# Altium schematic sheet DIGITAL-OUTPUT.SchDoc
size A
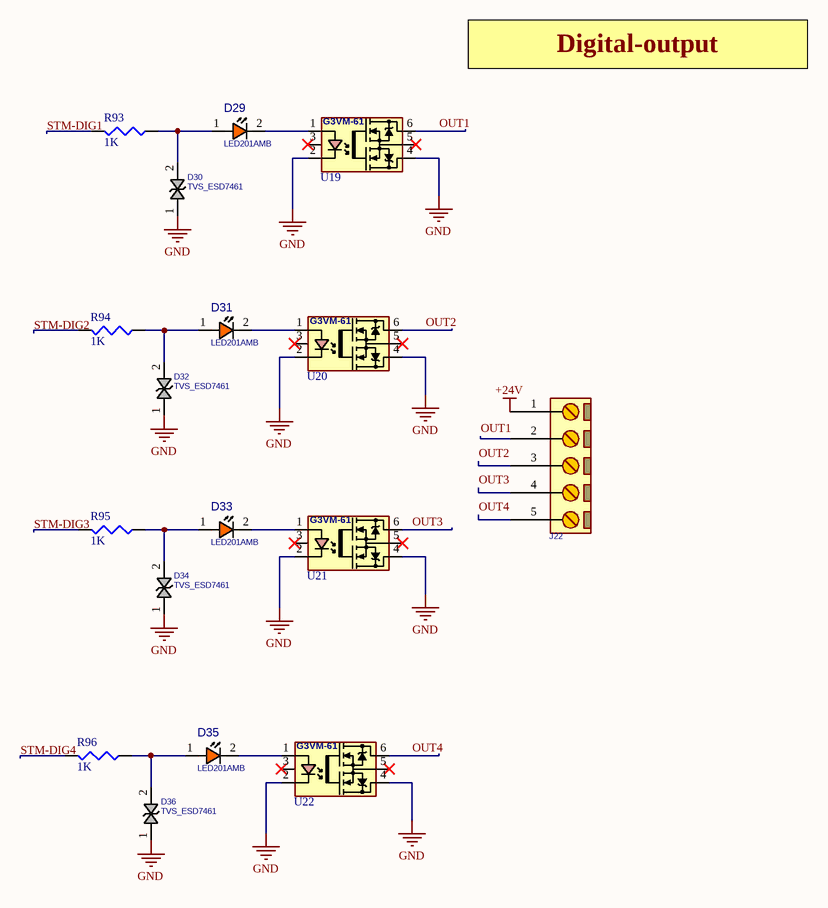
[diagram p0: DIGITAL-OUTPUT.SchDoc]

## Parts
D29  LED201AMB  [LED0201AMB]
D30  TVS_ESD7461  [ESD_XDFN2]
D31  LED201AMB  [LED0201AMB]
D32  TVS_ESD7461  [ESD_XDFN2]
D33  LED201AMB  [LED0201AMB]
D34  TVS_ESD7461  [ESD_XDFN2]
D35  LED201AMB  [LED0201AMB]
D36  TVS_ESD7461  [ESD_XDFN2]
J22  CONN_TB5  [MSTB_5]  (value not drawn)
R93  1K  [0603L]
R94  1K  [0603L]
R95  1K  [0603L]
R96  1K  [0603L]
U19  G3VM-61  [DIP_6SMD]  (value not drawn)
U20  G3VM-61  [DIP_6SMD]  (value not drawn)
U21  G3VM-61  [DIP_6SMD]  (value not drawn)
U22  G3VM-61  [DIP_6SMD]  (value not drawn)

## Nets
+24V: J22.1
GND: D30.1 D32.1 D34.1 D36.1 U19.2(K) U19.4 U20.2(K) U20.4 U21.2(K) U21.4 U22.2(K) U22.4
OUT1: J22.2 U19.6
OUT2: J22.3 U20.6
OUT3: J22.4 U21.6
OUT4: J22.5 U22.6
STM-DIG1: R93.2
STM-DIG2: R94.2
STM-DIG3: R95.2
STM-DIG4: R96.2
NetD29_1: D29.1(ANODE) D30.2 R93.1
NetD29_2: D29.2(CATHODE) U19.1(A)
NetD31_1: D31.1(ANODE) D32.2 R94.1
NetD31_2: D31.2(CATHODE) U20.1(A)
NetD33_1: D33.1(ANODE) D34.2 R95.1
NetD33_2: D33.2(CATHODE) U21.1(A)
NetD35_1: D35.1(ANODE) D36.2 R96.1
NetD35_2: D35.2(CATHODE) U22.1(A)

Not connected (* = marked no-connect by the designer): U19 3* 5*; U20 3* 5*; U21 3* 5*; U22 3* 5*

## Notes on the sheet
- Digital-output

## Library data of the parts
D29 D31 D33 D35 = LED_SMD_0201_AMB: LED, SMD, 0201, AMBER; PARAM: 20mA, 605nm, 140° Angle; MANF: Kingbright; DESC: DESCRIPTION; MANF_P#: APG0603SEC-TT; PARAM2: 2V, -40~85°C; ASSEMBLY: ASSEMBLY; PRICE: 0.5$; VALUE: LED201AMB
D30 D32 D34 D36 = TVS_ESD7461: TVS, ESD PROTECT, Bidirectional; MANF_P#: ESD7461N2T5G; MANF: ON; PARAM: 16.5VB; PRICE: 0.5$; VALUE: TVS_ESD7461
J22 = CONN_MSTB_5: CONN, PHOENIX MSTB, 5-G, 5.08mm pitch; VALUE: CONN_TB5
R93-R96 = Res3: RES SMD 1K OHM 1% 1/10W 0603; Manufacturer Part Number: RC1608F102CS; Published: 8-Jun-2000; LatestRevisionDate: 29-May-2009; LatestRevisionNote: IPC-7351 Footprint Added.; PackageReference: J1-0603; Publisher: Altium Limited; PackageDescription: Chip Resistor; Value: 1K; Digi-Key Part Number: 1276-3484-1-ND
U19-U22 = OPTC_MOS6P_G3VM-61E1: OPTOCOUPLER, MOS SSR, 6PIN; PRICE: PRICE; VALUE: G3VM-61